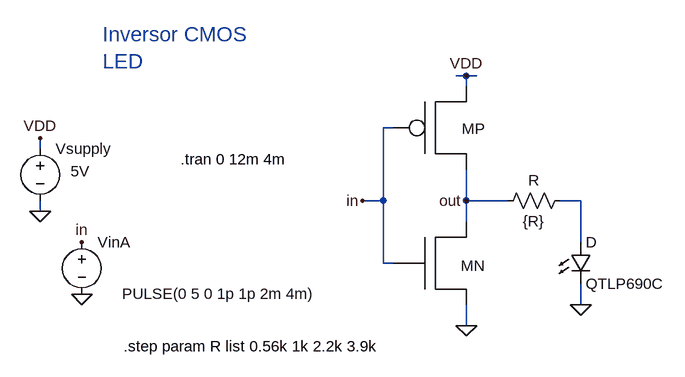
[diagram p0: schematic inverter-LED.asc]
inverter-LED.asc, the LTspice schematic file:
Version 4
SHEET 1 2472 680
WIRE 384 -128 368 -128
WIRE 400 -128 384 -128
WIRE 384 -112 384 -128
WIRE 272 -48 256 -48
WIRE -272 -16 -272 -32
WIRE 256 64 256 -48
WIRE 256 64 224 64
WIRE 384 64 384 16
WIRE 448 64 384 64
WIRE 560 64 528 64
WIRE -272 80 -272 64
WIRE 384 96 384 64
WIRE 560 128 560 64
WIRE 256 160 256 64
WIRE 272 160 256 160
WIRE 560 224 560 192
WIRE 384 256 384 224
FLAG -272 80 0
FLAG -208 208 0
FLAG -272 -32 VDD
FLAG -208 128 in
FLAG 384 -128 VDD
FLAG 384 64 out
FLAG 384 256 0
FLAG 224 64 in
FLAG 560 224 0
SYMBOL voltage -272 -32 R0
WINDOW 3 47 51 Left 2
SYMATTR Value 5V
SYMATTR InstName Vsupply
SYMBOL voltage -208 112 R0
WINDOW 123 0 0 Left 2
WINDOW 39 0 0 Left 2
WINDOW 3 62 95 Left 2
SYMATTR Value PULSE(0 5 0 1p 1p 2m 4m)
SYMATTR InstName VinA
SYMBOL PMOSX 352 -64 R0
SYMATTR InstName MP
SYMBOL NMOSX 352 144 R0
SYMATTR InstName MN
SYMBOL LED 544 128 R0
SYMATTR InstName D
SYMATTR Value QTLP690C
SYMATTR Description Diode
SYMATTR Type diode
SYMBOL res 544 48 R90
WINDOW 0 0 56 VBottom 2
WINDOW 3 32 56 VTop 2
SYMATTR InstName R
SYMATTR Value {R}
TEXT -56 0 Left 2 !.tran 0 12m 4m
TEXT -176 -192 Left 3 ;Inversor CMOS\nLED
TEXT -144 288 Left 2 !.step param R list 0.56k 1k 2.2k 3.9k

The netlist it stands for:
* inverter-LED.asc
Vsupply VDD 0 5V
VinA in 0 PULSE(0 5 0 1p 1p 2m 4m)
XMP out in VDD PMOSX  ; pins D G S
XMN out in 0 NMOSX  ; pins D G S
D N001 0 QTLP690C
R N001 out {R}
.model D D
.lib standard.dio
.tran 0 12m 4m
* Inversor CMOS
* LED
.step param R list 0.56k 1k 2.2k 3.9k
.lib MOS4007.txt
.backanno
.end